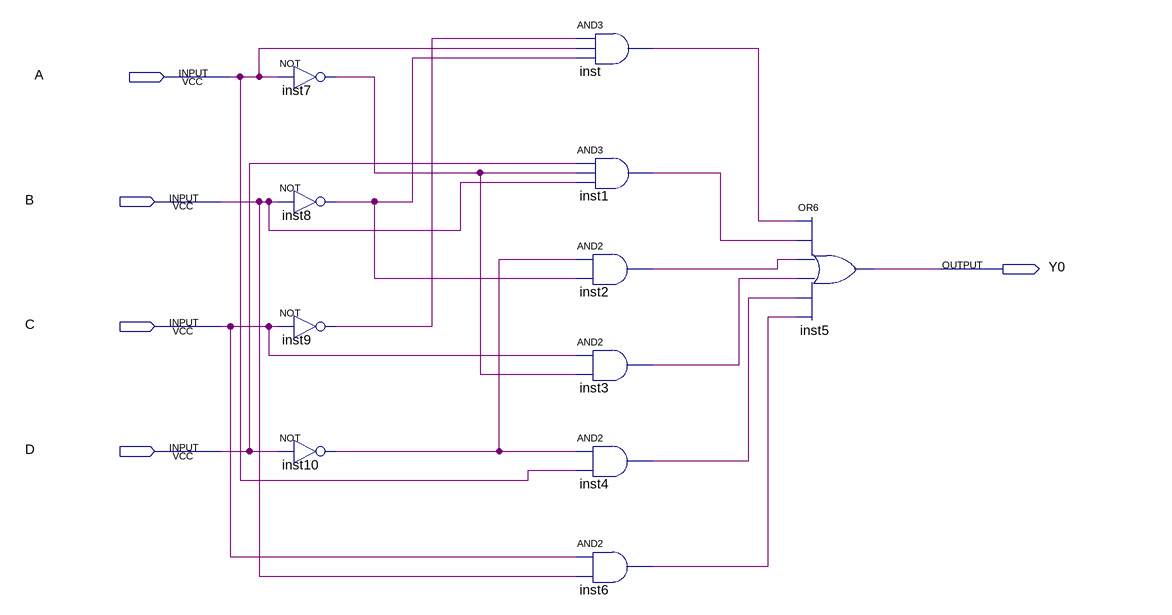
[diagram p0: schematic sheet]
// Quartus schematic zero.bdf as structural Verilog: 11 symbols, 5 pins
module zero (
  input  A,
  input  B,
  input  C,
  input  D,
  output Y0
);

  wire inst1_out, inst2_out, inst3_out, inst4_out, inst6_out, inst7_out, inst8_out, inst9_out, inst10_out,
       inst_out;

  not inst7 (inst7_out, A);
  not inst8 (inst8_out, B);
  not inst9 (inst9_out, C);
  not inst10 (inst10_out, D);
  and inst (inst_out, inst9_out, A, inst8_out);
  and inst1 (inst1_out, D, inst7_out, B);
  and inst2 (inst2_out, inst10_out, inst8_out);
  and inst3 (inst3_out, C, inst7_out);
  and inst4 (inst4_out, inst10_out, A);
  and inst6 (inst6_out, C, B);
  or inst5 (Y0, inst_out, inst1_out, inst2_out, inst3_out, inst4_out, inst6_out);
endmodule
